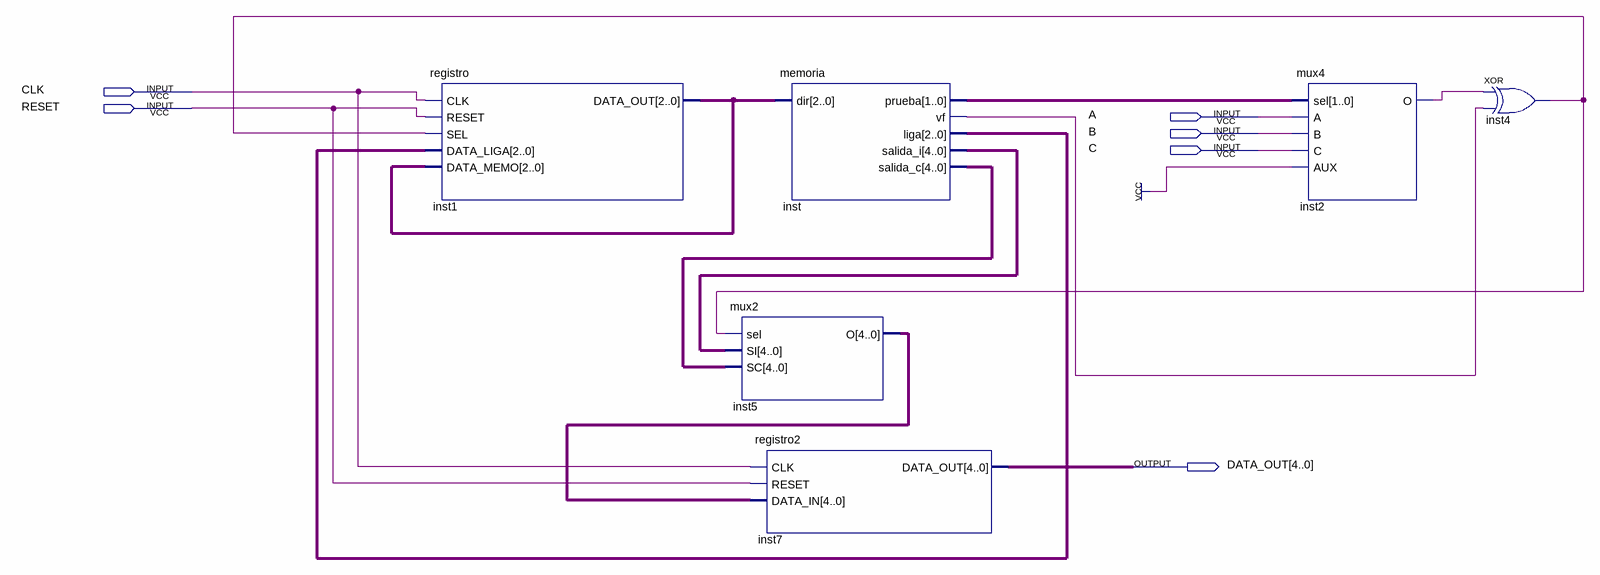
[diagram p0: schematic sheet]
// Quartus schematic tarea4.bdf as structural Verilog: 6 symbols, 6 pins
module tarea4 (
  input  CLK,
  input  RESET,
  input  A,
  input  B,
  input  C,
  output [4:0] DATA_OUT
);

  wire inst2_o, inst4_out, inst_vf;
  wire [1:0] inst_prueba;
  wire [2:0] inst1_data_out, inst_liga;
  wire [4:0] inst5_o, inst_salida_c, inst_salida_i;

  registro inst1 (
    .CLK(CLK), .RESET(RESET), .SEL(inst4_out), .DATA_LIGA(inst_liga), .DATA_MEMO(inst1_data_out),
    .DATA_OUT(inst1_data_out));
  memoria inst (
    .dir(inst1_data_out), .prueba(inst_prueba), .vf(inst_vf), .liga(inst_liga), .salida_i(inst_salida_i),
    .salida_c(inst_salida_c));
  mux2 inst5 (.sel(inst4_out), .SI(inst_salida_i), .SC(inst_salida_c), .O(inst5_o));
  registro2 inst7 (.CLK(CLK), .RESET(RESET), .DATA_IN(inst5_o), .DATA_OUT(DATA_OUT));
  mux4 inst2 (.sel(inst_prueba), .A(A), .B(B), .C(C), .AUX(1'b1), .O(inst2_o));
  xor inst4 (inst4_out, inst2_o, inst_vf);
endmodule
